# Altium schematic sheet Regulators.SchDoc
size B; SheetNumber: 8; SheetTotal: 8
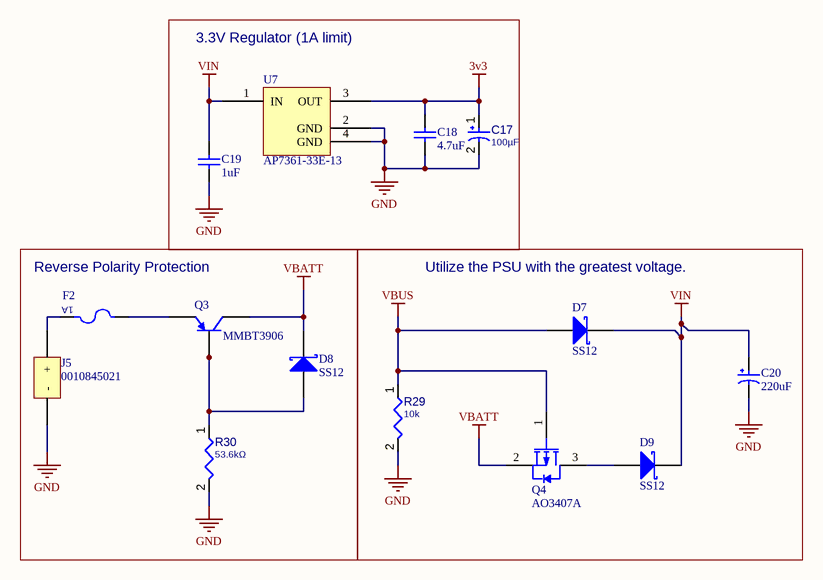
[diagram p0: Regulators.SchDoc]

## Parts
C17  value 100µF  [KEMT-T491-D_M]  (hidden comment: T491D107K010AT)
C18  Capacitance: 4.7uF  [Capacitor_0402]  (hidden comment: GRM155R60J475ME87D)
C19  Capacitance: 1uF  [Capacitor_0402]  (hidden comment: GRM155R61E105KA12D)
C20  Capacitance: 220uF  [CASE-D_7343]  (hidden comment: T491D227K010AT)
D7  SS12  [FAIR-DO-214AC-2_V]
D8  SS12  [FAIR-DO-214AC-2_V]
D9  SS12  [FAIR-DO-214AC-2_V]
F2  0466001.NRHF  [FP-0466-MFG]  (value not drawn)
J5  0010845021  [0010845021-Footprint-1]
Q3  MMBT3906  [FAIR-SOT23-3_V]
Q4  AO3407A  [AO3407A]
R29  value 10k  [RESC0402(1005)_L]  (hidden comment: Resistor 10K  +/-1 % 0402 63 mW)
R30  value 53.6kΩ  [RESC0402(1005)_L]  (hidden comment: 53D6KR2F)
U7  AP7361-33E-13  [AP7361-33E-13-Footprint-1]

## Blocks framed on the sheet
3.3V Regulator (1A limit): C17-C19 U7
Reverse Polarity Protection: D8 F2 J5 Q3 R30
Utilize the PSU with the greatest voltage.: C20 D7 D9 Q4 R29

## Nets
3v3: C17.1 C18.2 U7.3(OUT)
GND: C17.2 C18.1 C19.1 C20.2 J5.2(-) R29.2 R30.2 U7.2(GND) U7.4(GND)
VBATT: D8.2(K) Q3.3(C) Q4.2(SOURCE)
VBUS: D7.1(A) Q4.1(GATE) R29.1
VIN: C19.2 C20.1 D7.2(K) D9.2(K) U7.1(IN)
NetD8_1: D8.1(A) Q3.1(B) R30.1
NetD9_1: D9.1(A) Q4.3(DRAIN)
NetF2_1: F2.1 Q3.2(E)
NetF2_2: F2.2 J5.1(+)

## Library data of the parts
C17 = CMP-001-00037-5: Tantalum Surface Mount Capacitor-Standard Tantalum, 100 uF, +/- 10%, 10 V, -55 to 125 degC, 2917 (7343 Metric), RoHS, Tape and Reel; Manufacturer: Kemet; Ripple Current: 463mA; Voltage Rating: 10V; ESR: 700mohm; Manufacturer URL: http://www.kemet.com/; Case/Package: 2917; Tolerance: 10%; Datasheet URL: http://www.kemet.com/Lists/ProductCatalog/Attachments/254/KEM_T2005_T491.pdf; Packaging: TapeandReel; Pins: 2; Package Reference: T491-D; Package Description: 2-Pin Surface Mount Device, Body 7.3 x 4.3 mm; Min Operating Temperature: -55°C; Datasheet Version: Jun-16; Mounting Technology: SM; Package Quantity: 1; Capacitor Type: Tantalum; Max Operating Temperature: 125°C; RoHS Compliant: True
C18 = CMP-00000-1: 6.3V 4.7uF X5R ±20% 0402 Multilayer Ceramic Capacitors MLCC - SMD/SMT ROHS; Thickness: 0.022inch; Min Operating Temperature: -55°C; Case Code (Metric): 1005; Depth: 0.5mm; Tolerance: 20%; Width: 0.02inch; Series: GRM; Length: 1mm; Height: 0.5mm; Lead Free: Lead Free; Dielectric: X5R; Construction: Flat; REACH SVHC: No SVHC; Mount: Surface Mount; Radiation Hardening: No; Voltage Rating: 6.3V; RoHS Compliant: Yes; Packaging: Tape and Reel; Voltage Rating (DC): 6.3V; Package Quantity: 1; Max Operating Temperature: 85°C; Case Code (Imperial): 0402
C19 = CMP-001-0229-3: Chip Capacitor 1uF - 0402 25 V ±10% Tolerance X5R Multilayer Ceramic Chip Capacitor; Voltage Rating: 25V; Height: 0.5mm; Thickness: 0.022inch; Case Code (Imperial): 0402; Dielectric: X5R; Depth: 0.5mm; Series: GRM; Package Quantity: 10000; RoHS Compliant: Yes; Weight: 0.000212oz; Width: 0.5mm; Tolerance: 10%; Material: Ceramic; Case Code (Metric): 1005; Length: 1mm; Voltage Rating (DC): 25V; REACH SVHC: No SVHC; Max Operating Temperature: 85°C; Min Operating Temperature: -55°C; Packaging: Cut Tape; Termination: SMD/SMT; Lead Free: Lead Free; Mount: Surface Mount
C20 = CMP-001-0230-1: Cap Tant Solid 220uF 10V D CASE 10% (7.3 X 4.3 X 2.8mm) SMD 7343-31 0.5 Ohm 125 C T/R; Life (Hours): 2000Hour; ESR (Equivalent Series Resistance): 500mR; Leakage Current: 22uA; Ripple Current: 548mA; Dissipation Factor: 8%; Polarity: Polar; Dielectric Material: Tantalum; Case Code (Imperial): 2917; Lead Free: Lead Free; Radiation Hardening: No; Construction: Flat; Height: 2.8mm; Series: T491; Features: General Purpose; Length: 7.3mm; Weight: 0.023634oz; Min Operating Temperature: -55°C; RoHS Compliant: Yes; Case Code (Metric): 7343; REACH SVHC: No SVHC; Mount: Surface Mount,PCB; Height - Seated (Max): 0.122inch; Max Operating Temperature: 125°C; Failure Rate: 0.001%; Package Quantity: 1; Voltage Rating: 10V; Tolerance: 10%; Voltage Rating (DC): 10V; Depth: 4.3mm; Width: 4.3mm; Termination: SMD/SMT; Packaging: Tape and Reel
D7-D9 = CMP-004-00016-1: Schottky Rectifier, 20 V, 1 A, -65 to 125 degC, 2-Pin DO-214AC, RoHS, Tape and Reel; Manufacturer: Fairchild; Peak Reverse Current: 200uA; Max Surge Current: 40A; Forward Voltage: 5dV; Case/Package: SMA; Package URL: https://www.fairchildsemi.com/package-drawings/DO/DO214AC.pdf; Mounting Technology: SM; Package Quantity: 7500; Manufacturer URL: https://www.fairchildsemi.com/; Min Operating Temperature: -65°C; Packaging: TapeandReel; Package Description: 2-Pin Surface Mount Device, Body 4.375 x 2.725 mm; Datasheet Version: Rev. 1.9, 01/2015; Datasheet URL: https://www.fairchildsemi.com/datasheets/SS/SS12.pdf; Package Reference: DO-214AC-2; RoHS Compliant: True; Pins: 2; Max Operating Temperature: 125°C
F2 = CMP-007-00037-2: Fuse Chip Very Fast Acting 1A 63V SMD Solder Pad 1206 T/R CSA; Value: 1A
J5 = CMP-002-00077-1: Header Connector, pcb Mount, plug, 2 Contacts, skt, 0.25 Pitch, pc Tail Terminal, polarized Lck
Q3 = CMP-013-00008-2: PNP General-Purpose Amplifier, 40 V, 0.2 A, -55 to 150 degC, 3-Pin SOT23, RoHS, Tape and Reel; Manufacturer: Fairchild; hFE Min: 100; Package Version: Rev. 12, 03/2016; Power: 350mW; Vce Max: 400mV; Frequency: 250MHz; Elements: 1; Min Operating Temperature: -55°C; Package Reference: SOT23-3; Package Description: 3-Pin Small Outline Transistor, Body 2.92 x 1.325 mm, Pitch 0.95 mm; Datasheet URL: https://www.fairchildsemi.com/datasheets/MM/MMBT3906.pdf; Datasheet Version: Rev. 1.2.2, 04/2014; RoHS Compliant: True; Package Quantity: 3000; Case/Package: TO-236-3; Pins: 3; Mounting Technology: SM; Packaging: TapeandReel; Max Operating Temperature: 150°C
Q4 = AO3407A: P-Channel 30 V 4.3A (Ta) 1.4W (Ta) Surface Mount SOT-23-3
R29 = CMP-009-00149-2: Chip Resistor, 10 kOhms, +/-1 %, 63 mW, -55 to 125 degC, 0402; Power: 63mW; Tolerance: 1%; Pins: 2; Max Operating Temperature: 155°C; Min Operating Temperature: -55°C; Case/Package: 0402
R30 = CMP-009-00107-1: 53K6 0.063W 1% 0402 (1005 Metric)  SMD; Power: 63mW; Mounting Technology: SMT; Case/Package: 0402; Tolerance: 1%; Pins: 2
U7 = CMP-019-00051-1: AP7361 Series 3.3 V 1 A Low SMT Dropout Fixed-Mode Regulator - SOT-223